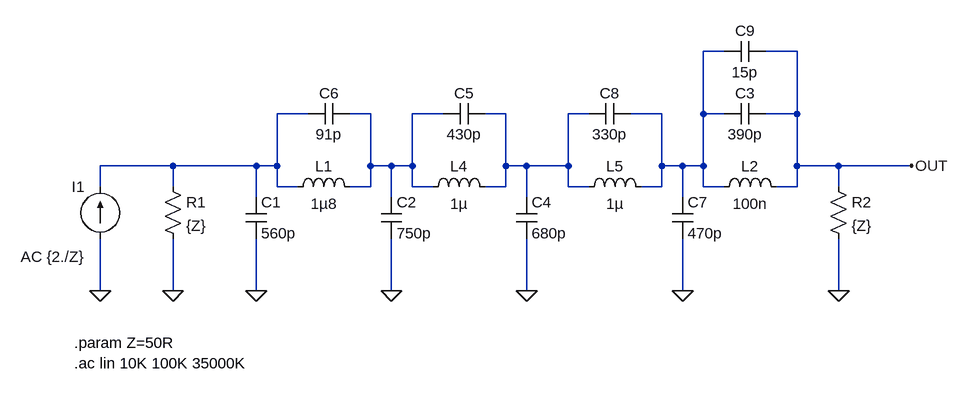
[diagram p0: schematic filter.asc]
filter.asc, the LTspice schematic file:
Version 4
SHEET 1 1624 680
WIRE 816 -80 784 -80
WIRE 928 -80 880 -80
WIRE 176 16 128 16
WIRE 272 16 240 16
WIRE 384 16 336 16
WIRE 480 16 448 16
WIRE 608 16 576 16
WIRE 720 16 672 16
WIRE 784 16 784 -80
WIRE 816 16 784 16
WIRE 928 16 928 -80
WIRE 928 16 880 16
WIRE -32 96 -144 96
WIRE 96 96 -32 96
WIRE 128 96 128 16
WIRE 128 96 96 96
WIRE 272 96 272 16
WIRE 304 96 272 96
WIRE 336 96 336 16
WIRE 336 96 304 96
WIRE 480 96 480 16
WIRE 512 96 480 96
WIRE 576 96 576 16
WIRE 576 96 512 96
WIRE 720 96 720 16
WIRE 752 96 720 96
WIRE 784 96 784 16
WIRE 784 96 752 96
WIRE 928 96 928 16
WIRE 992 96 928 96
WIRE 1104 96 992 96
WIRE -144 128 -144 96
WIRE -32 128 -32 96
WIRE 128 128 128 96
WIRE 160 128 128 128
WIRE 272 128 272 96
WIRE 272 128 240 128
WIRE 336 128 336 96
WIRE 368 128 336 128
WIRE 480 128 480 96
WIRE 480 128 448 128
WIRE 576 128 576 96
WIRE 608 128 576 128
WIRE 720 128 720 96
WIRE 720 128 688 128
WIRE 784 128 784 96
WIRE 816 128 784 128
WIRE 928 128 928 96
WIRE 928 128 896 128
WIRE 992 128 992 96
WIRE 96 144 96 96
WIRE 304 144 304 96
WIRE 512 144 512 96
WIRE 752 144 752 96
WIRE -144 288 -144 208
WIRE -32 288 -32 208
WIRE 96 288 96 208
WIRE 304 288 304 208
WIRE 512 288 512 208
WIRE 752 288 752 208
WIRE 992 288 992 208
FLAG -32 288 0
FLAG 96 288 0
FLAG 304 288 0
FLAG 992 288 0
FLAG -144 288 0
FLAG 1104 96 OUT
FLAG 512 288 0
FLAG 752 288 0
SYMBOL ind 144 144 R270
WINDOW 0 32 56 VTop 2
WINDOW 3 5 56 VBottom 2
SYMATTR InstName L1
SYMATTR Value 1µ8
SYMBOL cap 80 144 R0
SYMATTR InstName C1
SYMATTR Value 560p
SYMBOL cap 288 144 R0
SYMATTR InstName C2
SYMATTR Value 750p
SYMBOL res -48 112 R0
SYMATTR InstName R1
SYMATTR Value {Z}
SYMBOL res 976 112 R0
SYMATTR InstName R2
SYMATTR Value {Z}
SYMBOL current -144 208 R180
WINDOW 0 24 80 Left 2
WINDOW 3 24 0 Left 2
WINDOW 123 24 -28 Left 2
WINDOW 39 0 0 Left 0
SYMATTR InstName I1
SYMATTR Value ""
SYMATTR Value2 AC {2./Z}
SYMBOL cap 880 0 R90
WINDOW 0 0 32 VBottom 2
WINDOW 3 32 32 VTop 2
SYMATTR InstName C3
SYMATTR Value 390p
SYMBOL ind 800 144 R270
WINDOW 0 32 56 VTop 2
WINDOW 3 5 56 VBottom 2
SYMATTR InstName L2
SYMATTR Value 100n
SYMBOL ind 352 144 R270
WINDOW 0 32 56 VTop 2
WINDOW 3 5 56 VBottom 2
SYMATTR InstName L4
SYMATTR Value 1µ
SYMBOL cap 496 144 R0
SYMATTR InstName C4
SYMATTR Value 680p
SYMBOL cap 448 0 R90
WINDOW 0 0 32 VBottom 2
WINDOW 3 32 32 VTop 2
SYMATTR InstName C5
SYMATTR Value 430p
SYMBOL cap 240 0 R90
WINDOW 0 0 32 VBottom 2
WINDOW 3 32 32 VTop 2
SYMATTR InstName C6
SYMATTR Value 91p
SYMBOL cap 672 0 R90
WINDOW 0 0 32 VBottom 2
WINDOW 3 32 32 VTop 2
SYMATTR InstName C8
SYMATTR Value 330p
SYMBOL ind 592 144 R270
WINDOW 0 32 56 VTop 2
WINDOW 3 5 56 VBottom 2
SYMATTR InstName L5
SYMATTR Value 1µ
SYMBOL cap 736 144 R0
SYMATTR InstName C7
SYMATTR Value 470p
SYMBOL cap 880 -96 R90
WINDOW 0 0 32 VBottom 2
WINDOW 3 32 32 VTop 2
SYMATTR InstName C9
SYMATTR Value 15p
TEXT -184 400 Left 2 !.ac lin 10K 100K 35000K
TEXT -184 368 Left 2 !.param Z=50R

The netlist it stands for:
* filter.asc
L1 N002 N003 1µ8
C1 N002 0 560p
C2 N003 0 750p
R1 N002 0 {Z}
R2 OUT 0 {Z}
I1 0 N002 AC {2./Z}
C3 OUT N001 390p
L2 N001 OUT 100n
L4 N003 N004 1µ
C4 N004 0 680p
C5 N004 N003 430p
C6 N003 N002 91p
C8 N001 N004 330p
L5 N004 N001 1µ
C7 N001 0 470p
C9 OUT N001 15p
.ac lin 10K 100K 35000K
.param Z=50R
.backanno
.end